# Altium schematic sheet RELAY16.SchDoc
size A
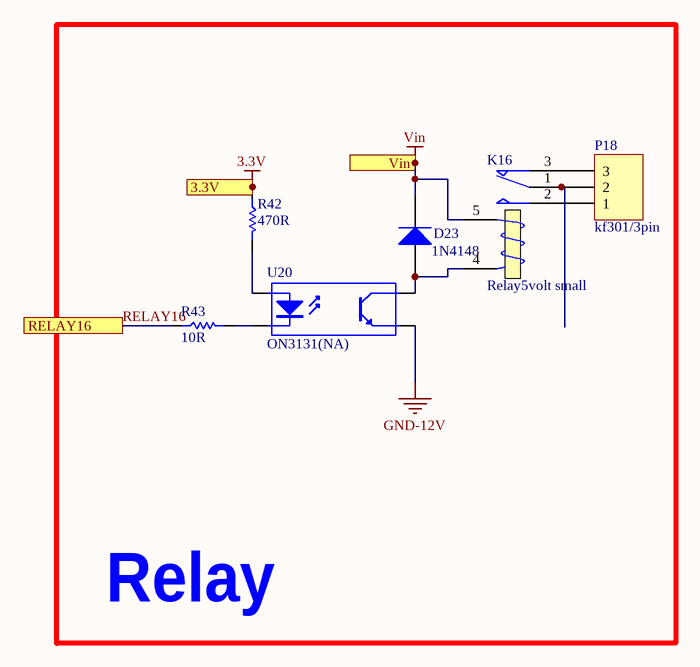
[diagram p0: RELAY16.SchDoc]

## Parts
D23  1N4148  [sod123]
K16  Relay5volt small  [relay5_childern]
P18  kf301/3pin  [Blue Connector 1*3 -kf301]
R42  470R  [0805/resistor]
R43  10R  [0805/resistor]
U20  ON3131(NA)  [OPTO_COUPLER]

## Blocks framed on the sheet
Relay: D23 K16 P18 R42 R43 U20

## Ports
3.3V, RELAY16, Vin

## Nets
3.3V: R42.1 ; port 3.3V
GND-12V: U20.3(E)
Vin: D23.K K16.5 ; port Vin
RELAY16: R43.1 ; port RELAY16
NetD23_A: D23.A K16.4(T2) U20.4(C)
NetK16_1: K16.1(COM) P18.2
NetK16_2: K16.2(NO) P18.1
NetK16_3: K16.3(T1) P18.3
NetR42_2: R42.2 U20.1(A)
NetR43_2: R43.2 U20.2(K)

## Library data of the parts
D23 = Diode 1N4007: 1 Amp General Purpose Rectifier; Published: 8-Jun-2000; LatestRevisionDate: 17-Jul-2002; LatestRevisionNote: Re-released for DXP Platform.; DatasheetVersion: 1998; PackageVersion: Aug-1999; PackageReference: DO-41; Publisher: Altium Limited; PackageDescription: Diode, Axial; Body 5.2 x 2.7 mm (LxDia. max), Lead Dia. 0.86 mm (max); Code_JEDEC: DO-204-AL; ComponentLink1Description: Manufacturer Link; ComponentLink1URL: http://www.fairchildsemi.com/; ComponentLink2Description: Datasheet; ComponentLink2URL: http://www.fairchildsemi.com/ds/1N%2F1N4001.pdf
K16 = Relay: SPDT Relay; Published: 8-Jun-2000; LatestRevisionDate: 17-Jul-2002; LatestRevisionNote: Re-released for DXP Platform.; PackageReference: MODULE5B; Publisher: Altium Limited
P18 = Header 3: LatestRevisionDate: 17-Jul-2002; LatestRevisionNote: Re-released for DXP Platform.; Publisher: Altium Limited
R42 R43 = Resistor: Tolerance: 5%; Power: 1/8 W
  R42: Value: 470R
  R43: Value: 10R
U20 = Optoisolator1: 4-Pin Phototransistor Optocoupler; Published: 24-Mar-1999; LatestRevisionDate: 04-Mar-2005; LatestRevisionNote: Sch pins 3 & 4 Swapped.; DatasheetVersion: Nov-2003; PackageReference: DIP-4; Publisher: Altium Limited